# Altium schematic sheet Sheet_1.schdoc
size 321 x 219 mm
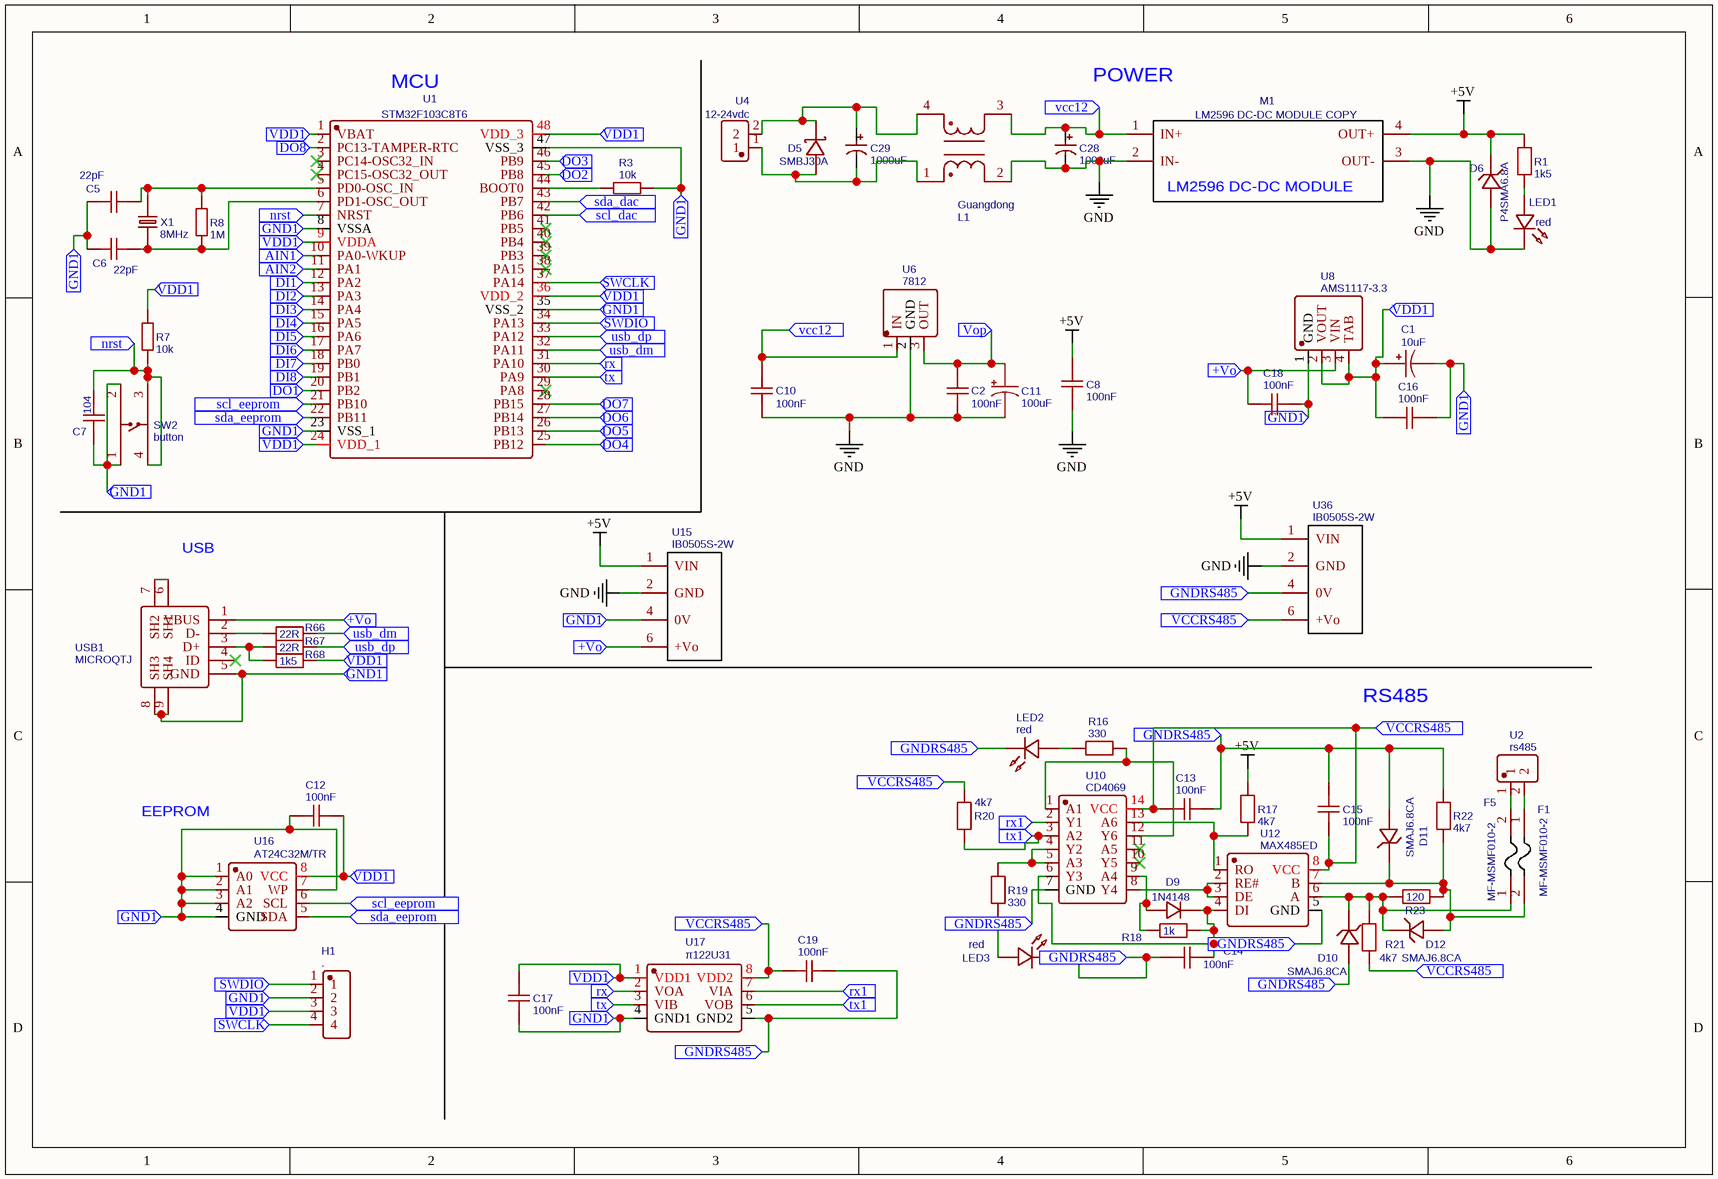
[diagram p0: Sheet_1.schdoc]

## Parts
C1  10uF  [CAP-TH_BD5.0-P2.00-D0.8-FD]
C2  100nF  [C1206]
C5  22pF  [C1206]
C6  22pF  [C1206]
C7  104  [C1206]
C8  100nF  [C1206]
C10  100nF  [C1206]
C11  100uF  [CAP-TH_BD8.0-P3.50-D0.6-FD]
C12  100nF  [C1206]
C13  100nF  [C1206]
C14  100nF  [C1206]
C15  100nF  [C1206]
C16  100nF  [C1206]
C17  100nF  [C1206]
C18  100nF  [C1206]
C19  100nF  [C1206]
C28  1000uF  [CAP-TH_BD12.5-P5.00-D0.6-FD]
C29  1000uF  [CAP-TH_BD12.5-P5.00-D0.6-FD]
D5  SMBJ30A  [SMB_L4.6-W3.6-LS5.3-R-RD]
D6  P4SMA6.8A  [SMA_L4.4-W2.6-LS5.0-RD]
D9  1N4148  [SOD-123F_L2.7-W1.7-LS3.7-RD-1]
D10  SMAJ6.8CA  [SMA_L4.4-W2.6-LS5.0-BI]
D11  SMAJ6.8CA  [SMA_L4.4-W2.6-LS5.0-BI]
D12  SMAJ6.8CA  [SMA_L4.4-W2.6-LS5.0-BI]
F1  MF-MSMF010-2  [F1812]
F5  MF-MSMF010-2  [F1812]
H1  .  [HDR-TH_4P-P2.54-V-M-1]
L1  Guangdong  [FILTER-TH_4P-L16.5-W11.5-P8.00-D0.6-S7.00]
LED1  red  [LED1206-RD]
LED2  red  [LED1206-RD]
LED3  red  [LED1206-RD]
M1  LM2596 DC-DC MODULE COPY  [LM2596 MODULE]
R1  1k5  [R1206]
R3  10k  [R1206]
R7  10k  [R1206]
R8  1M  [R1206]
R16  330  [R1206]
R17  4k7  [R1206]
R18  1k  [R1206]
R19  330  [R1206]
R20  4k7  [R1206]
R21  4k7  [R1206]
R22  4k7  [R1206]
R23  120  [R1206]
R66  22R  [R1206]
R67  22R  [R1206]
R68  1k5  [R1206]
SW2  button  [KEY-TH_4P-L6.0-W6.0-P4.50-LS6.5]
U1  STM32F103C8T6  [LQFP-48_L7.0-W7.0-P0.50-LS9.0-BL]
U2  rs485  [CONN-TH_DG127-5.08-02P-14-02A]
U4  12-24vdc  [CONN-TH_DG127-5.08-02P-14-02A]
U6  7812  [TO-220-3_L10.0-W4.5-P2.54-L]
U8  AMS1117-3.3  [PG-SOT223-4_L6.5-W3.5-P2.30-LS7.0-BR]
U10  CD4069  [SOP-14]
U12  MAX485ED  [SOP-8_L4.9-W3.9-P1.27-LS6.0-BL]
U15  IB0505S-2W  [PWRM-TH_IBXXXXS-2W]
U16  AT24C32M/TR  [SOP-8_L4.9-W3.9-P1.27-LS6.0-BL]
U17  π122U31  [SOIC-8_L4.9-W3.9-P1.27-LS6.0-BL]
U36  IB0505S-2W  [PWRM-TH_IBXXXXS-2W]
USB1  MICROQTJ  [MICRO-USB-SMD_MICROQTJ]
X1  8MHz  [HC-49S_L11.4-W4.8]

## Ports
+Vo (in), AIN1 (in), AIN2 (in), DI1 (in), DI2 (in), DI3 (in), DI4 (in), DI5 (in), DI6 (in), DI7 (in), DI8 (in), DO1 (in), DO2 (in), DO3 (in), DO4 (in), DO5 (in), DO6 (in), DO7 (in), DO8 (in), GND1 (in), GNDRS485 (in), nrst (in), rx1 (in), rx (in), scl_dac (in), scl_eeprom (in), sda_dac (in), sda_eeprom (in), SWCLK (in), SWDIO (in), tx1 (in), tx (in), usb_dm (in), usb_dp (in), vcc12 (in), VCCRS485 (in), VDD1 (in), Vop (in)

## Nets
+5V: C8.1 D6.1(C) M1.4(OUT+) R1.2 R17.2 U15.1(VIN) U36.1(VIN)
GND: C2.1 C8.2 C10.1 C11.2 C28.2 D6.2(A) L1.2 LED1.2 M1.2(IN-) M1.3(OUT-) U6.2(GND) U15.2(GND) U36.2(GND)
+Vo: C18.2 U8.3(VIN) U15.6(+Vo) USB1.1(VBUS) ; port +Vo
AIN1: U1.10(PA0-WKUP) ; port AIN1
AIN2: U1.11(PA1) ; port AIN2
DI1: U1.12(PA2) ; port DI1
DI2: U1.13(PA3) ; port DI2
DI3: U1.14(PA4) ; port DI3
DI4: U1.15(PA5) ; port DI4
DI5: U1.16(PA6) ; port DI5
DI6: U1.17(PA7) ; port DI6
DI7: U1.18(PB0) ; port DI7
DI8: U1.19(PB1) ; port DI8
DO1: U1.20(PB2) ; port DO1
DO2: U1.45(PB8) ; port DO2
DO3: U1.46(PB9) ; port DO3
DO4: U1.25(PB12) ; port DO4
DO5: U1.26(PB13) ; port DO5
DO6: U1.27(PB14) ; port DO6
DO7: U1.28(PB15) ; port DO7
DO8: U1.2(PC13-TAMPER-RTC) ; port DO8
GND1: C1.2 C5.1 C6.1 C7.1 C12.2 C16.1 C17.2 C18.1 H1.2 R3.2 SW2.1 SW2.2 U1.8(VSSA) U1.23(VSS_1) U1.35(VSS_2) U1.47(VSS_3) U8.1(GND) U15.4(0V) U16.1(A0) U16.2(A1) U16.3(A2) U16.4(GND) U16.7(WP) U17.4(GND1) USB1.5(GND) USB1.8(SH3) USB1.9(SH4) ; port GND1
GNDRS485: C13.1 C14.1 C14.2 C15.1 C19.1 D9.1(C) D10.2(A) D11.2(A) LED2.2 LED3.2 R18.1 R22.2 U10.6(Y3) U10.7(GND) U12.4(DI) U12.5(GND) U17.5(GND2) U36.4(0V) ; port GNDRS485
nrst: C7.2 R7.1 SW2.3 SW2.4 U1.7(NRST) ; port nrst
rx: U1.31(PA10) U17.2(VOA) ; port rx
rx1: U10.2(Y1) U17.7(VIA) ; port rx1
scl_dac: U1.42(PB6) ; port scl_dac
scl_eeprom: U1.21(PB10) U16.6(SCL) ; port scl_eeprom
sda_dac: U1.43(PB7) ; port sda_dac
sda_eeprom: U1.22(PB11) U16.5(SDA) ; port sda_eeprom
SWCLK: H1.4 U1.37(PA14) ; port SWCLK
SWDIO: H1.1 U1.34(PA13) ; port SWDIO
tx: U1.30(PA9) U17.3(VIB) ; port tx
tx1: R20.1 U10.3(A2) U17.6(VOB) ; port tx1
usb_dm: R66.1 U1.32(PA11) ; port usb_dm
usb_dp: R67.1 U1.33(PA12) ; port usb_dp
vcc12: C10.2 C28.1 L1.3 M1.1(IN+) U6.1(IN) ; port vcc12
VCCRS485: C13.2 C15.2 C19.2 R20.2 R21.1 U10.14(VCC) U12.8(VCC) U17.8(VDD2) U36.6(+Vo) ; port VCCRS485
VDD1: C1.1 C12.1 C16.2 C17.1 H1.3 R7.2 R68.1 U1.1(VBAT) U1.9(VDDA) U1.24(VDD_1) U1.36(VDD_2) U1.48(VDD_3) U8.2(VOUT) U8.4(TAB) U16.8(VCC) U17.1(VDD1) ; port VDD1
Vop: C2.2 C11.1 U6.3(OUT) ; port Vop
NetC5_2: C5.2 R8.2 U1.5(PD0-OSC_IN) X1.2
NetC6_2: C6.2 R8.1 U1.6(PD1-OSC_OUT) X1.1
NetC29_1: C29.1 D5.2(K) L1.4 U4.2
NetC29_2: C29.2 D5.1(A) L1.1 U4.1
NetD9_2: D9.2(A) R18.2 U10.9(A4)
NetD10_1: D10.1(C) D12.1(C) F5.1 R21.2 R23.2 U12.6(A)
NetD11_1: D11.1(C) D12.2(A) F1.2 R22.1 R23.1 U12.7(B)
NetF1_1: F1.1 U2.2
NetF5_2: F5.2 U2.1
NetLED1_1: LED1.1 R1.1
NetLED2_1: LED2.1 R16.1
NetLED3_1: LED3.1 R19.1
NetR3_1: R3.1 U1.44(BOOT0)
NetR16_2: R16.2 U10.1(A1) U10.12(Y6)
NetR17_1: R17.1 U10.13(A6) U12.1(RO)
NetR19_2: R19.2 U10.4(Y2) U10.5(A3)
NetR66_2: R66.2 USB1.2(D-)
NetR67_2: R67.2 R68.2 USB1.3(D+)
NetU10_8: U10.8(Y4) U12.2(RE#) U12.3(DE)
NetUSB1_6: USB1.6(SH1) USB1.7(SH2)

Not connected (* = marked no-connect by the designer): U1 3(PC14-OSC32_IN)* 4(PC15-OSC32_OUT)* 29(PA8)* 38(PA15)* 39(PB3)* 40(PB4)* 41(PB5)*; U10 10(Y5)* 11(A5)*; USB1 4(ID)*

## Notes on the sheet
- (near U1) MCU
- POWER
- (near USB1) USB
- RS485
- EEPROM
- (in symbol LM2596 DC-DC MODULE COPY) LM2596 DC-DC MODULE

## Library data of the parts
C1 = 10uF: BOM_Manufacturer: KNSCHA; BOM_Manufacturer Part: 01EC1809SHC10UF50V; nameAlias: Capacitance; Contributor: LCSC; BOM_Supplier: LCSC; BOM_Supplier Part: C503219; BOM_JLCPCB Part Class: Extended Part; spicePre: C; spiceSymbolName: 01EC1809SHC10UF50V
C2 C8 C10 C12-C19 = 100nF: BOM_Manufacturer: Dersonic; BOM_Manufacturer Part: CC1H333ZA1PD3F4D30MF; nameAlias: Capacitance; Contributor: LCSC; BOM_Supplier: LCSC; BOM_Supplier Part: C254075; BOM_JLCPCB Part Class: Extended Part; spicePre: C; spiceSymbolName: CC1H333ZA1PD3F4D30MF
C5 C6 = 22pF: BOM_Manufacturer: Guangdong Fenghua Advanced Tech; BOM_Manufacturer Part: CC1-F5U2J2B330KSPW; nameAlias: Capacitance; Contributor: LCSC; SMT Type: Extend; BOM_Supplier: LCSC; BOM_Supplier Part: C277970; BOM_LCSC Assembly: Yes; spicePre: C; spiceSymbolName: CC1-F5U2J2B330KSPW
C7 = 104: BOM_Manufacturer: Guangdong Fenghua Advanced Tech; BOM_Manufacturer Part: CC1-F5U2J2B330KSPW; nameAlias: Capacitance; Contributor: LCSC; SMT Type: Extend; BOM_Supplier: LCSC; BOM_Supplier Part: C277970; BOM_LCSC Assembly: Yes; spicePre: C; spiceSymbolName: CC1-F5U2J2B330KSPW
C11 = 100uF: BOM_Manufacturer: KNSCHA; BOM_Manufacturer Part: 01EC1227SHC470UF25V; nameAlias: Capacitance; Contributor: LCSC; BOM_Supplier: LCSC; BOM_Supplier Part: C503221; BOM_JLCPCB Part Class: Extended Part; spicePre: C; spiceSymbolName: 01EC1227SHC470UF25V
C28 C29 = 1000uF: BOM_Manufacturer: ValuePro; BOM_Manufacturer Part: 1000uF 35V 13*20; nameAlias: Capacitance; BOM_Supplier: LCSC; BOM_Supplier Part: C10749; BOM_JLCPCB Part Class: Extended Part; spicePre: C; spiceSymbolName: 1000uF 35V 13*20
D5 = SMBJ30A: BOM_Manufacturer: SOCAY Elec; Contributor: LCSC; BOM_Supplier: LCSC; BOM_Supplier Part: C305669; BOM_Manufacturer Part: SMBJ30A; spicePre: D; spiceSymbolName: SMBJ30A_C305669
D6 = P4SMA6.8A: BOM_Manufacturer: UMW(友台半导体); Contributor: LCSC; BOM_Supplier: LCSC; BOM_Supplier Part: C2758558; BOM_Manufacturer Part: P4SMA6.8A; spicePre: D; spiceSymbolName: P4SMA6.8A_C2758558
D9 = 1N4148: BOM_Manufacturer: STARSEA; BOM_Supplier: LCSC; BOM_Manufacturer Part: 1N4148; BOM_Supplier Part: C85057; BOM_JLCPCB Part Class: Extended Part; spicePre: D; spiceSymbolName: 1N4148-C85057
D10-D12 = SMAJ6.8CA: BOM_Manufacturer: Brightking Elec (TAIWAN); BOM_Manufacturer Part: 1.5KE12A; Contributor: LCSC; BOM_Supplier: LCSC; BOM_Supplier Part: C521797; BOM_JLCPCB Part Class: Extended Part; spicePre: D; spiceSymbolName: 1.5KE12A_C521797
F1 F5 = MF-MSMF010-2: BOM_Manufacturer: BOURNS; BOM_Supplier: LCSC; BOM_Manufacturer Part: MF-MSMF010-2; BOM_Supplier Part: C12430; BOM_JLCPCB Part Class: Extended Part; spicePre: F; spiceSymbolName: MF-MSMF010-2
H1 = .: BOM_Manufacturer: JILN; BOM_Manufacturer Part: 12251104CNSNS295001; Contributor: LCSC; BOM_Supplier: LCSC; BOM_Supplier Part: C355292; BOM_JLCPCB Part Class: Extended Part; spicePre: H; spiceSymbolName: 12251104CNSNS295001
L1 = Guangdong: BOM_Manufacturer: Guangdong Fenghua Advanced Tech; BOM_Manufacturer Part: UU9.8-5mH; nameAlias: Value; Contributor: LCSC; BOM_Supplier: LCSC; BOM_Supplier Part: C116373; BOM_JLCPCB Part Class: Extended Part; spicePre: L; spiceSymbolName: UU9.8-5MH
LED1-LED3 = red: BOM_Manufacturer: HONGLITRONIC(Hongli Zhihui (HONGLITRONIC)); BOM_Manufacturer Part: HL-503H3GD; Contributor: LCSC; BOM_Supplier: LCSC; BOM_Supplier Part: C568941; spicePre: L; spiceSymbolName: HL-503H3GD
M1 = LM2596 DC-DC MODULE COPY: BOM_Manufacturer Part: New SchematicLib; Contributor: erikkate; spicePre: M; spiceSymbolName: LM2596 DC-DC MODULE COPY
R1 R68 = 1k5: BOM_Manufacturer: TyoHM; BOM_Manufacturer Part: RN 1/4W 1K5 F T/B A1; nameAlias: Resistance (Ohms); Contributor: LCSC; BOM_Supplier: LCSC; BOM_Supplier Part: C410678; spicePre: R; spiceSymbolName: RN 1/4W 1K5 F T/B A1
R3 R7 = 10k: BOM_Manufacturer: Chian Chia Elec; nameAlias: Resistance (Ohms); Contributor: LCSC; BOM_Supplier: LCSC; BOM_Supplier Part: C120038; BOM_Manufacturer Part: -; BOM_JLCPCB Part Class: Extended Part; spicePre: R; spiceSymbolName: CF1/4W-200Ω±5% T52
R8 = 1M: BOM_Manufacturer: Chian Chia Elec; nameAlias: Resistance (Ohms); Contributor: LCSC; BOM_Supplier: LCSC; BOM_Supplier Part: C120038; BOM_Manufacturer Part: -; BOM_JLCPCB Part Class: Extended Part; spicePre: R; spiceSymbolName: CF1/4W-200Ω±5% T52
R16 R19 = 330: BOM_Manufacturer: TyoHM; BOM_Manufacturer Part: RN 1/4W 1K5 F T/B A1; nameAlias: Resistance (Ohms); Contributor: LCSC; BOM_Supplier: LCSC; BOM_Supplier Part: C410678; spicePre: R; spiceSymbolName: RN 1/4W 1K5 F T/B A1
R17 R20-R22 = 4k7: BOM_Manufacturer: TyoHM; BOM_Manufacturer Part: RN 1/4W 1K5 F T/B A1; nameAlias: Resistance (Ohms); Contributor: LCSC; BOM_Supplier: LCSC; BOM_Supplier Part: C410678; spicePre: R; spiceSymbolName: RN 1/4W 1K5 F T/B A1
R18 = 1k: BOM_Manufacturer: TyoHM; BOM_Manufacturer Part: RN 1/4W 1K5 F T/B A1; nameAlias: Resistance (Ohms); Contributor: LCSC; BOM_Supplier: LCSC; BOM_Supplier Part: C410678; spicePre: R; spiceSymbolName: RN 1/4W 1K5 F T/B A1
R23 = 120: BOM_Manufacturer: TyoHM; BOM_Manufacturer Part: RN 1/4W 1K5 F T/B A1; nameAlias: Resistance (Ohms); Contributor: LCSC; BOM_Supplier: LCSC; BOM_Supplier Part: C410678; spicePre: R; spiceSymbolName: RN 1/4W 1K5 F T/B A1
R66 R67 = 22R: BOM_Manufacturer: TyoHM; BOM_Manufacturer Part: RN 1/4W 1K5 F T/B A1; nameAlias: Resistance (Ohms); Contributor: LCSC; BOM_Supplier: LCSC; BOM_Supplier Part: C410678; spicePre: R; spiceSymbolName: RN 1/4W 1K5 F T/B A1
SW2 = button: BOM_Manufacturer: C&K; BOM_Manufacturer Part: PTS645SL432LFS; Contributor: LCSC; SMT Type: Extend; BOM_Paste Type: expand; BOM_Supplier: LCSC; BOM_Supplier Part: C285482; BOM_LCSC Assembly: Yes; spicePre: S; spiceSymbolName: PTS645SL432LFS
U1 = STM32F103C8T6: BOM_Manufacturer: STMicroelectronics; timeStamp: 1455028086; BOM_Supplier: LCSC; BOM_Manufacturer Part: STM32F103C8T6; BOM_Supplier Part: C8734; BOM_JLCPCB Part Class: Basic Part; spicePre: U; spiceSymbolName: STM32F103C8T6
U2 = rs485: BOM_Manufacturer: DEGSON; BOM_Manufacturer Part: DG127-5.08-02P-14-02A(H); Contributor: LCSC; BOM_Supplier: LCSC; BOM_Supplier Part: C691860; spicePre: U; spiceSymbolName: DG127-5.08-02P-14-02A(H)
U4 = 12-24vdc: BOM_Manufacturer: DEGSON; BOM_Manufacturer Part: DG127-5.08-02P-14-02A(H); Contributor: LCSC; BOM_Supplier: LCSC; BOM_Supplier Part: C691860; spicePre: U; spiceSymbolName: DG127-5.08-02P-14-02A(H)
U6 = 7812: BOM_Manufacturer: Foshan Blue Rocket Elec; Contributor: LCSC; BOM_Supplier: LCSC; BOM_Supplier Part: C358369; BOM_Manufacturer Part: 7812; BOM_JLCPCB Part Class: Extended Part; spicePre: U; spiceSymbolName: 7812
U8 = AMS1117-3.3: BOM_Manufacturer: HGC(Huaguan Semicon); Contributor: LCSC; BOM_Supplier: LCSC; BOM_Supplier Part: C498117; BOM_Manufacturer Part: AMS1117-3.3; BOM_JLCPCB Part Class: Extended Part; spicePre: U; spiceSymbolName: AMS1117-3.3_C498117
U10 = CD4069: BOM_Manufacturer: HGSEMI(华冠); BOM_Manufacturer Part: 74HC14N; Contributor: LCSC; BOM_Supplier: LCSC; BOM_Supplier Part: C507186; BOM_JLCPCB Part Class: Extended Part; spicePre: U; spiceSymbolName: 74HC14N
U12 = MAX485ED: BOM_Manufacturer: MAXIM; BOM_Manufacturer Part: MAX485EPA+; BOM_Supplier: LCSC; BOM_Supplier Part: C45829; BOM_JLCPCB Part Class: Extended Part; spicePre: U; spiceSymbolName: MAX485EPA+
U15 U36 = IB0505S-2W: BOM_Manufacturer: MORNSUN; BOM_Supplier: LCSC; BOM_Manufacturer Part: IB0505S-2W; BOM_Supplier Part: C9758; BOM_JLCPCB Part Class: Extended Part; spicePre: U; spiceSymbolName: IB0505S-2W
U16 = AT24C32M/TR: BOM_Manufacturer: HGSEMI(华冠); Contributor: LCSC; BOM_Supplier: LCSC; BOM_Supplier Part: C2688466; BOM_Manufacturer Part: AT24C32M/TR; BOM_JLCPCB Part Class: Extended Part; spicePre: U; spiceSymbolName: AT24C32M/TR
U17 = π122U31: BOM_Manufacturer: 2Pai Semi; Contributor: LCSC; BOM_Supplier: LCSC; BOM_Supplier Part: C471590; BOM_Manufacturer Part: π122U31; BOM_JLCPCB Part Class: Extended Part; spicePre: U; spiceSymbolName: π122U31
USB1 = MICROQTJ: BOM_Manufacturer: SHOU HAN; Contributor: LCSC; BOM_Supplier: LCSC; BOM_Supplier Part: C404968; BOM_Manufacturer Part: MicroQTJ; BOM_JLCPCB Part Class: Extended Part; spicePre: U; spiceSymbolName: MICROQTJ
X1 = 8MHz: BOM_Manufacturer: Suzhou Liming Elec; BOM_Manufacturer Part: 49S-7.6-20-20-20/A; nameAlias: Frequency; Contributor: LCSC; BOM_Supplier: LCSC; BOM_Supplier Part: C240941; BOM_JLCPCB Part Class: Extended Part; spicePre: X; spiceSymbolName: 49S-7.6-20-20-20/A